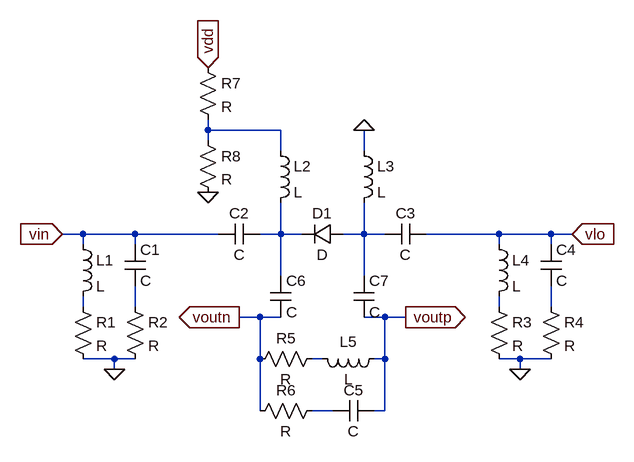
[diagram p0: schematic core.asc]
core.asc, the LTspice schematic file:
Version 4
SHEET 1 880 680
WIRE 160 -80 160 -96
WIRE 272 -80 160 -80
WIRE 160 -64 160 -80
WIRE 272 -48 272 -80
WIRE 400 -48 400 -80
WIRE -32 80 -64 80
WIRE 48 80 -32 80
WIRE 176 80 48 80
WIRE 272 80 272 32
WIRE 272 80 240 80
WIRE 304 80 272 80
WIRE 400 80 400 32
WIRE 400 80 368 80
WIRE 432 80 400 80
WIRE 608 80 496 80
WIRE 688 80 608 80
WIRE 720 80 688 80
WIRE -32 96 -32 80
WIRE 48 96 48 80
WIRE 608 96 608 80
WIRE 688 96 688 80
WIRE 272 144 272 80
WIRE 400 144 400 80
WIRE -32 192 -32 176
WIRE 48 192 48 160
WIRE 608 192 608 176
WIRE 688 192 688 160
WIRE 240 208 208 208
WIRE 272 208 240 208
WIRE 432 208 400 208
WIRE 464 208 432 208
WIRE 16 272 -32 272
WIRE 48 272 16 272
WIRE 240 272 240 208
WIRE 336 272 320 272
WIRE 432 272 432 208
WIRE 432 272 416 272
WIRE 640 272 608 272
WIRE 688 272 640 272
WIRE 16 288 16 272
WIRE 640 288 640 272
WIRE 240 352 240 272
WIRE 352 352 320 352
WIRE 432 352 432 272
WIRE 432 352 416 352
FLAG 16 288 0
FLAG 640 288 0
FLAG -64 80 vin
IOPIN -64 80 In
FLAG 464 208 voutp
IOPIN 464 208 Out
FLAG 208 208 voutn
IOPIN 208 208 Out
FLAG 720 80 vlo
IOPIN 720 80 In
FLAG 400 -80 0
FLAG 160 16 0
FLAG 160 -176 vdd
IOPIN 160 -176 In
SYMBOL ind -48 80 R0
SYMATTR InstName L1
SYMBOL cap 32 96 R0
SYMATTR InstName C1
SYMBOL res -48 176 R0
SYMATTR InstName R1
SYMBOL res 32 176 R0
SYMATTR InstName R2
SYMBOL diode 368 64 R90
WINDOW 0 0 32 VBottom 2
WINDOW 3 32 32 VTop 2
SYMATTR InstName D1
SYMBOL cap 240 64 R90
WINDOW 0 0 32 VBottom 2
WINDOW 3 32 32 VTop 2
SYMATTR InstName C2
SYMBOL ind 256 -64 R0
SYMATTR InstName L2
SYMBOL cap 496 64 R90
WINDOW 0 0 32 VBottom 2
WINDOW 3 32 32 VTop 2
SYMATTR InstName C3
SYMBOL ind 384 -64 R0
SYMATTR InstName L3
SYMBOL ind 592 80 R0
SYMATTR InstName L4
SYMBOL cap 672 96 R0
SYMATTR InstName C4
SYMBOL res 592 176 R0
SYMATTR InstName R3
SYMBOL res 672 176 R0
SYMATTR InstName R4
SYMBOL ind 432 256 R90
WINDOW 0 5 56 VBottom 2
WINDOW 3 32 56 VTop 2
SYMATTR InstName L5
SYMBOL cap 416 336 R90
WINDOW 0 0 32 VBottom 2
WINDOW 3 32 32 VTop 2
SYMATTR InstName C5
SYMBOL res 336 256 R90
WINDOW 0 0 56 VBottom 2
WINDOW 3 32 56 VTop 2
SYMATTR InstName R5
SYMBOL res 336 336 R90
WINDOW 0 0 56 VBottom 2
WINDOW 3 32 56 VTop 2
SYMATTR InstName R6
SYMBOL cap 256 144 R0
SYMATTR InstName C6
SYMBOL cap 384 144 R0
SYMATTR InstName C7
SYMBOL res 144 -192 R0
SYMATTR InstName R7
SYMBOL res 144 -80 R0
SYMATTR InstName R8

The netlist it stands for:
* core.asc
L1 vin N004 L
C1 vin N005 C
R1 N004 0 R
R2 N005 0 R
D1 N003 N002 D
C2 N002 vin C
L2 N001 N002 L
C3 vlo N003 C
L3 0 N003 L
L4 vlo N006 L
C4 vlo N007 C
R3 N006 0 R
R4 N007 0 R
L5 voutp N008 L
C5 voutp N009 C
R5 N008 voutn R
R6 N009 voutn R
C6 N002 voutn C
C7 N003 voutp C
R7 vdd N001 R
R8 N001 0 R
.model D D
.lib standard.dio
.backanno
.end